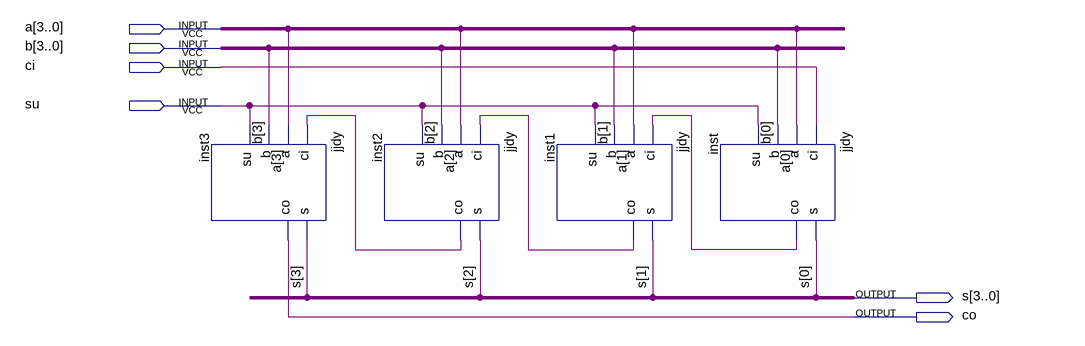
[diagram p0: schematic sheet]
// Quartus schematic jjfq0.bdf as structural Verilog: 4 symbols, 6 pins
module jjfq0 (
  input  [3:0] a,
  input  [3:0] b,
  input  ci,
  input  su,
  output [3:0] s,
  output co
);

  wire inst1_co, inst2_co, inst_co;

  jjdy inst3 (.ci(inst2_co), .a(a[3]), .b(b[3]), .su(su), .s(s[3]), .co(co));
  jjdy inst2 (.ci(inst1_co), .a(a[2]), .b(b[2]), .su(su), .s(s[2]), .co(inst2_co));
  jjdy inst1 (.ci(inst_co), .a(a[1]), .b(b[1]), .su(su), .s(s[1]), .co(inst1_co));
  jjdy inst (.ci(ci), .a(a[0]), .b(b[0]), .su(su), .s(s[0]), .co(inst_co));
endmodule
